# EasyEDA schematic schematic.easyeda.json
TITLE: Lunatic MIDI interface: Fatar keyboard; REV: 1.0; Date: 2019-04-14; Sheet: 1/1; Drawn By: Marco Sacchi; Company: Lunatic Electronics
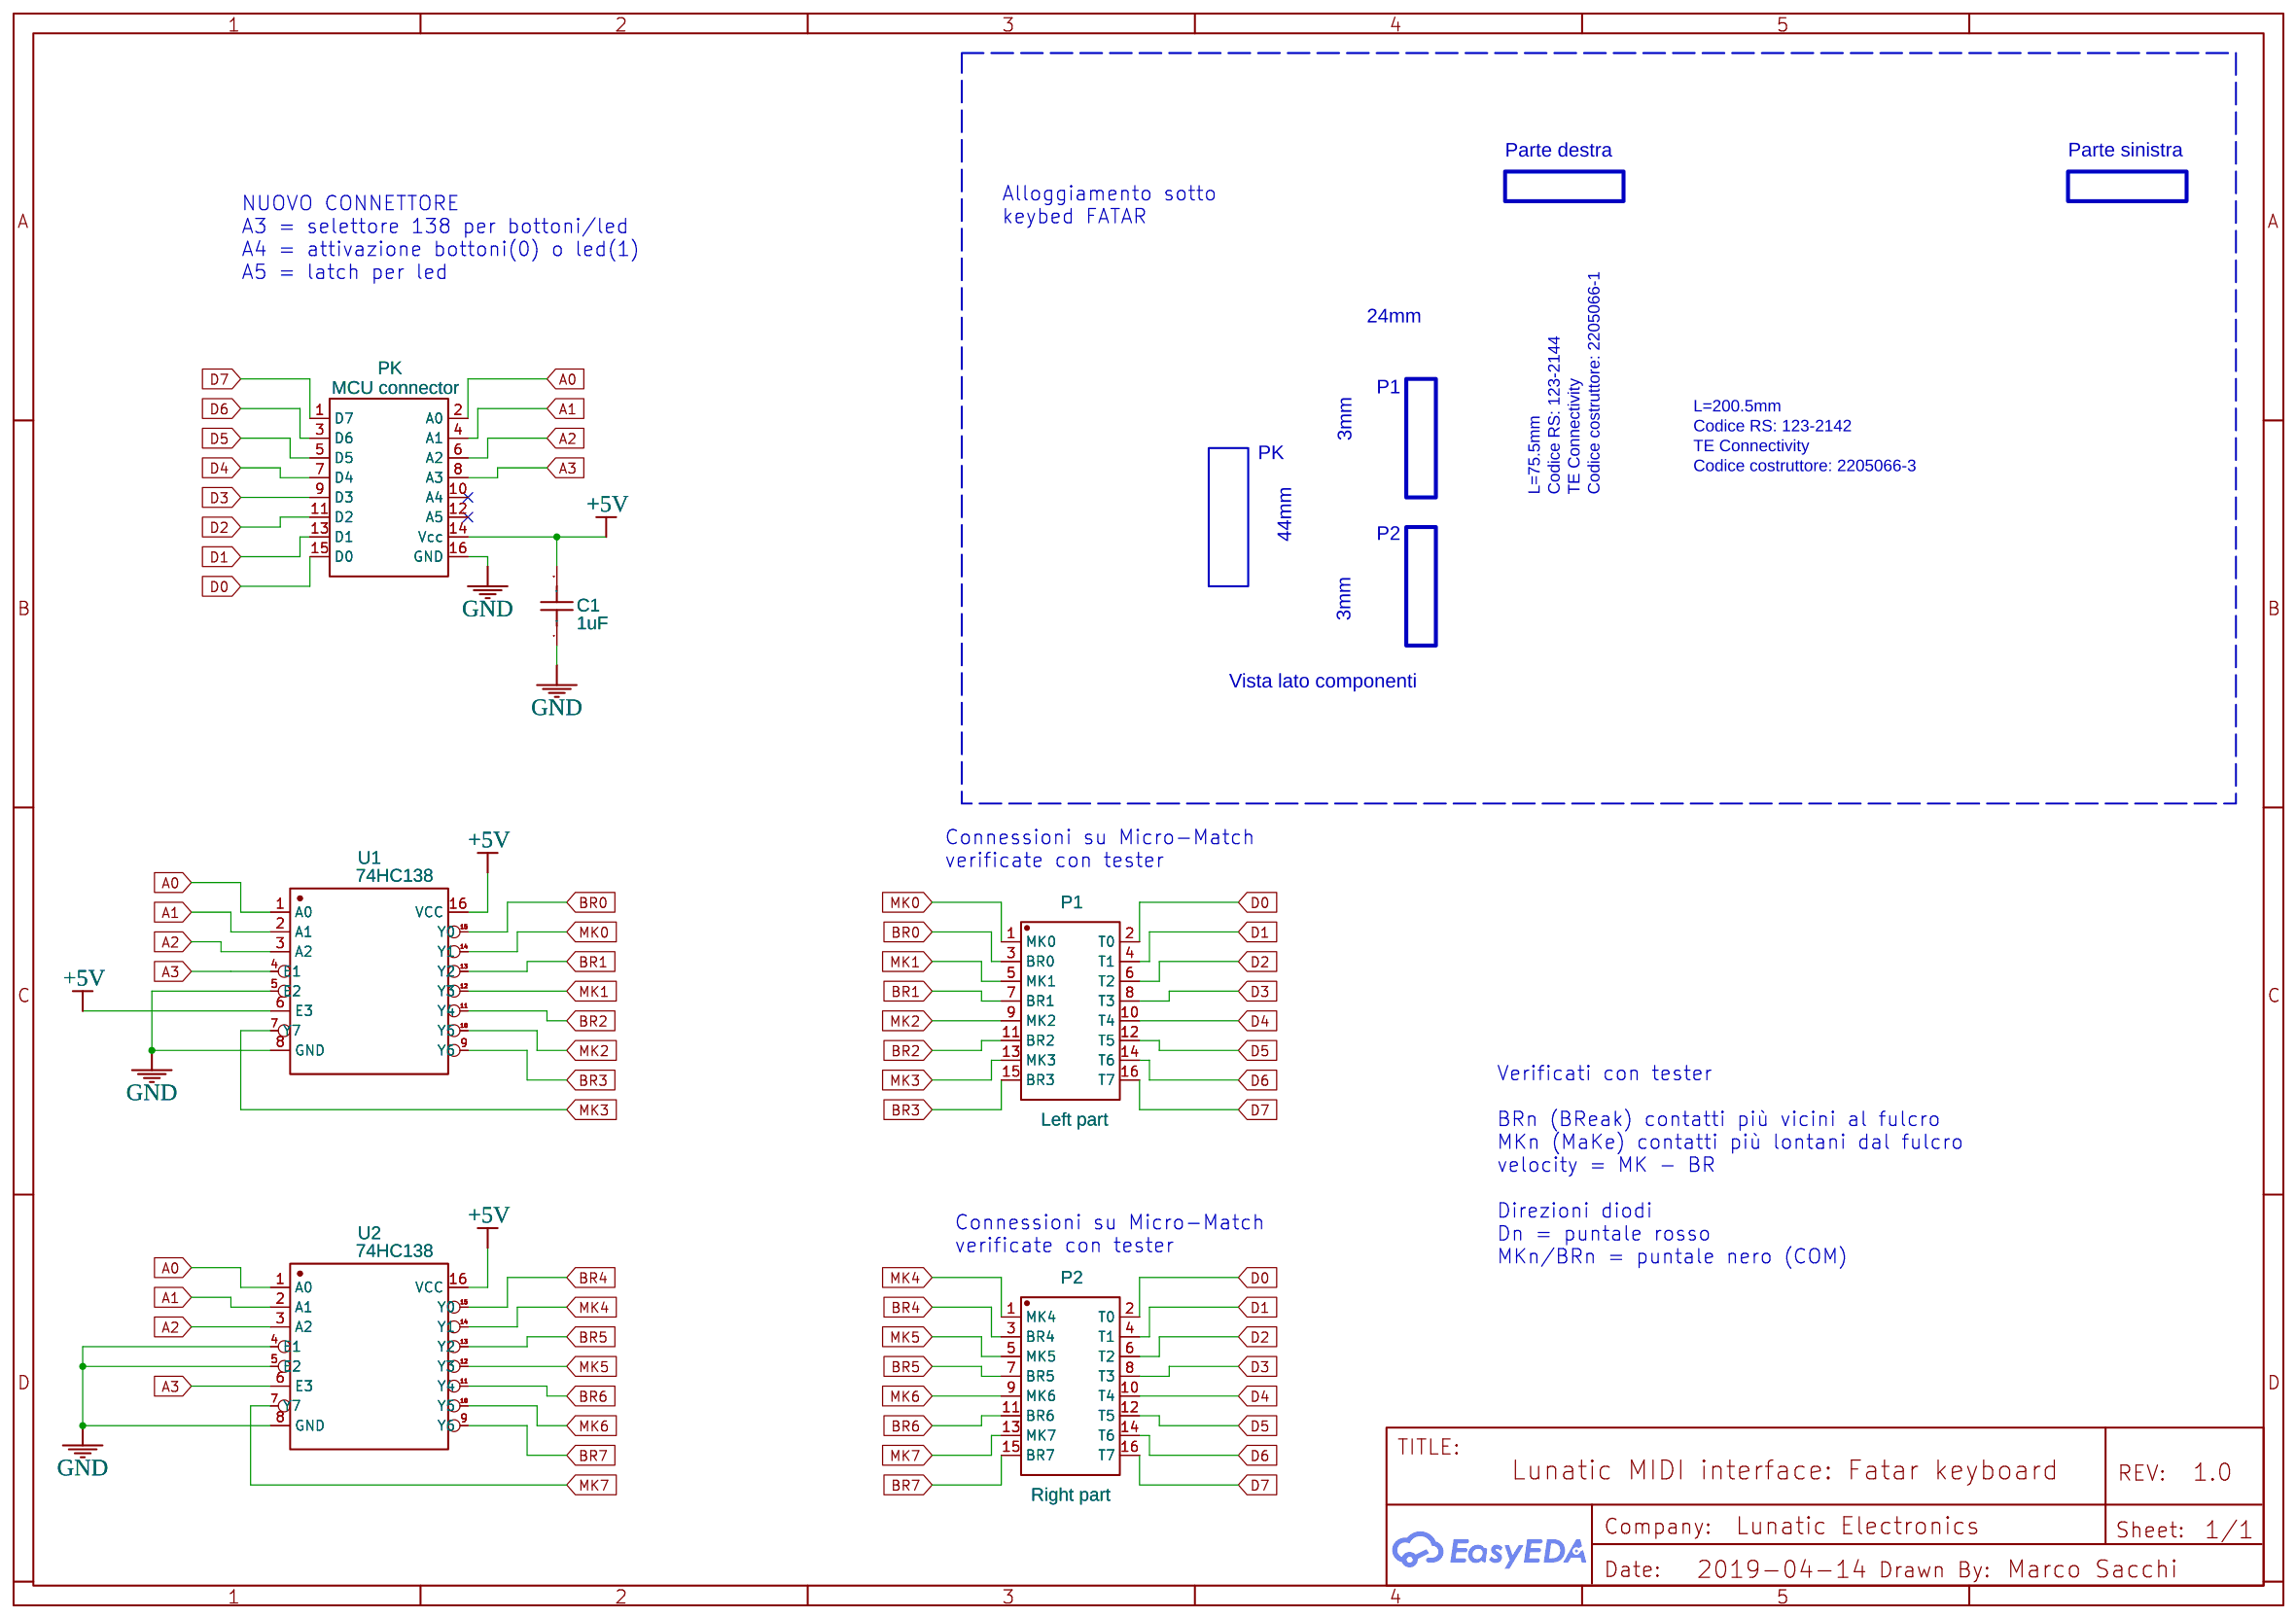
[diagram p0: schematic sheet]

## Parts
C1  1uF  [RAD-0.1]
P1  Left part  [MICRO-MATCH_16PIN_THRU_HOLE]
P2  Right part  [MICRO-MATCH_16PIN_THRU_HOLE]
PK  MCU connector  [HDR-8X2/2.54]
U1  74HC138  [DIP-16]
U2  74HC138  [DIP-16]

## Library data of the parts
C1 = Cap_RAD-0.1_US: Manufacturer Part: ?
P1 P2 = -: Manufacturer Part: 1-215079-6; Supplier: RS-Online; Supplier Part: 680-4980; Contributor: Lunatic electronics; link: https://docs-emea.rs-online.com/webdocs/0d8f/0900766b80d8fa2b.pdf; Manufacturer: TE Connectivity
PK = -: Manufacturer Part: GEM; image: //image.lceda.cn/szlcsc/C30734.jpg
U1 U2 = -: Manufacturer: STMicroelectronics; Supplier Part: C5194; Contributor: Lunatic electronics

## Nets
+5V: C1.2 PK.14(Vcc) U1.6(E3) U1.16(VCC) U2.16(VCC)
GND: C1.1 PK.16(GND) U1.5(E2) U1.8(GND) U2.4(E1) U2.5(E2) U2.8(GND)
A0: PK.2(A0) U1.1(A0) U2.1(A0)
A1: PK.4(A1) U1.2(A1) U2.2(A1)
A2: PK.6(A2) U1.3(A2) U2.3(A2)
A3: PK.8(A3) U1.4(E1) U2.6(E3)
BR0: P1.3(BR0) U1.15(Y0)
BR1: P1.7(BR1) U1.13(Y2)
BR2: P1.11(BR2) U1.11(Y4)
BR3: P1.15(BR3) U1.9(Y6)
BR4: P2.3(BR4) U2.15(Y0)
BR5: P2.7(BR5) U2.13(Y2)
BR6: P2.11(BR6) U2.11(Y4)
BR7: P2.15(BR7) U2.9(Y6)
D0: P1.2(T0) P2.2(T0) PK.15(D0)
D1: P1.4(T1) P2.4(T1) PK.13(D1)
D2: P1.6(T2) P2.6(T2) PK.11(D2)
D3: P1.8(T3) P2.8(T3) PK.9(D3)
D4: P1.10(T4) P2.10(T4) PK.7(D4)
D5: P1.12(T5) P2.12(T5) PK.5(D5)
D6: P1.14(T6) P2.14(T6) PK.3(D6)
D7: P1.16(T7) P2.16(T7) PK.1(D7)
MK0: P1.1(MK0) U1.14(Y1)
MK1: P1.5(MK1) U1.12(Y3)
MK2: P1.9(MK2) U1.10(Y5)
MK3: P1.13(MK3) U1.7(Y7)
MK4: P2.1(MK4) U2.14(Y1)
MK5: P2.5(MK5) U2.12(Y3)
MK6: P2.9(MK6) U2.10(Y5)
MK7: P2.13(MK7) U2.7(Y7)

Not connected (* = marked no-connect by the designer): PK 10(A4)* 12(A5)*

## Notes on the sheet
- Parte destra
- Parte sinistra
- Alloggiamento sotto
  keybed FATAR
- NUOVO CONNETTORE
  A3 = selettore 138 per bottoni/led
  A4 = attivazione bottoni(0) o led(1)
  A5 = latch per led
- 24mm
- P1
- L=200.5mm
  Codice RS: 123-2142
  TE Connectivity
  Codice costruttore: 2205066-3
- 3mm
- PK
- L=75.5mm
  Codice RS: 123-2144
  TE Connectivity
  Codice costruttore: 2205066-1
- P2
- 44mm
- 3mm
- Vista lato componenti
- Connessioni su Micro-Match
  verificate con tester
- Verificati con tester
  BRn (BReak) contatti più vicini al fulcro
  MKn (MaKe) contatti più lontani dal fulcro
  velocity = MK - BR
  Direzioni diodi
  Dn = puntale rosso
  MKn/BRn = puntale nero (COM)
- Connessioni su Micro-Match
  verificate con tester
